# Altium project robotShield.PrjPcb
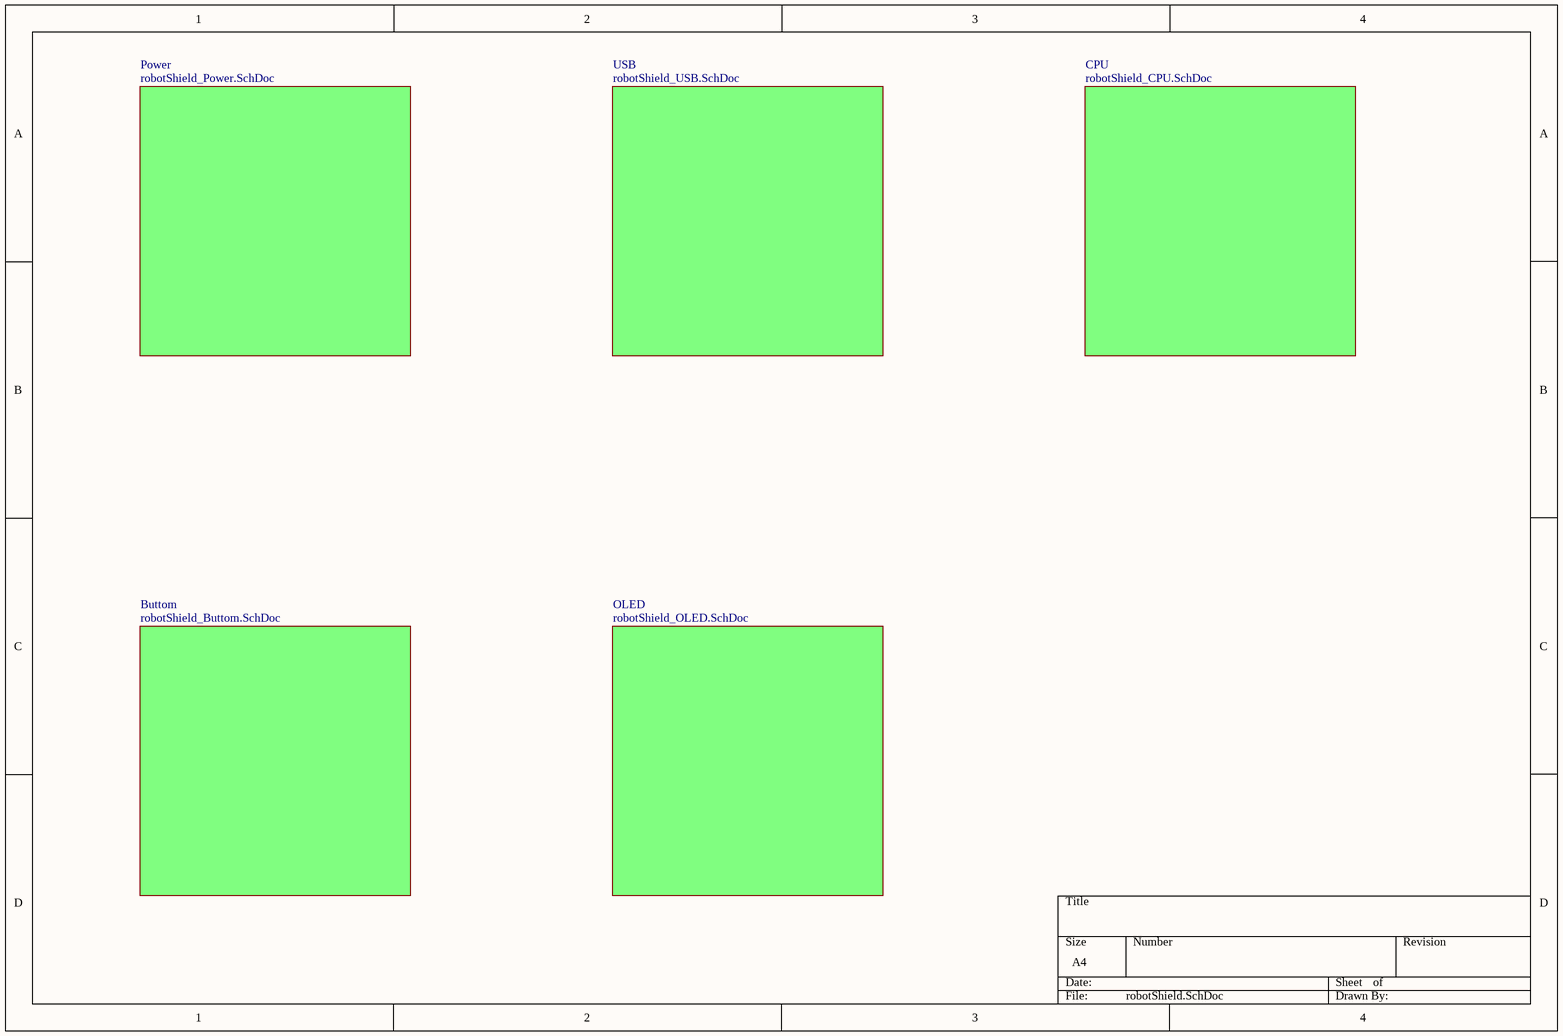
[diagram p0: robotShield.SchDoc]
6 sheets, 66 parts. Net scope: flat (ports and power ports of the same name join across sheets).
Board file: robotShield.PcbDoc
Sheets:
  robotShield.SchDoc
    Power = robotShield_Power.SchDoc
    USB = robotShield_USB.SchDoc
    CPU = robotShield_CPU.SchDoc
    Buttom = robotShield_Buttom.SchDoc
    OLED = robotShield_OLED.SchDoc

## Sheet robotShield.SchDoc
size A4; SheetNumber: 1; SheetTotal: 5

### Sub-sheets
Buttom = robotShield_Buttom.SchDoc: no entries
CPU = robotShield_CPU.SchDoc: no entries
OLED = robotShield_OLED.SchDoc: no entries
Power = robotShield_Power.SchDoc: no entries
USB = robotShield_USB.SchDoc: no entries

## Sheet robotShield_Power.SchDoc
size A4; SheetNumber: 2; SheetTotal: 6
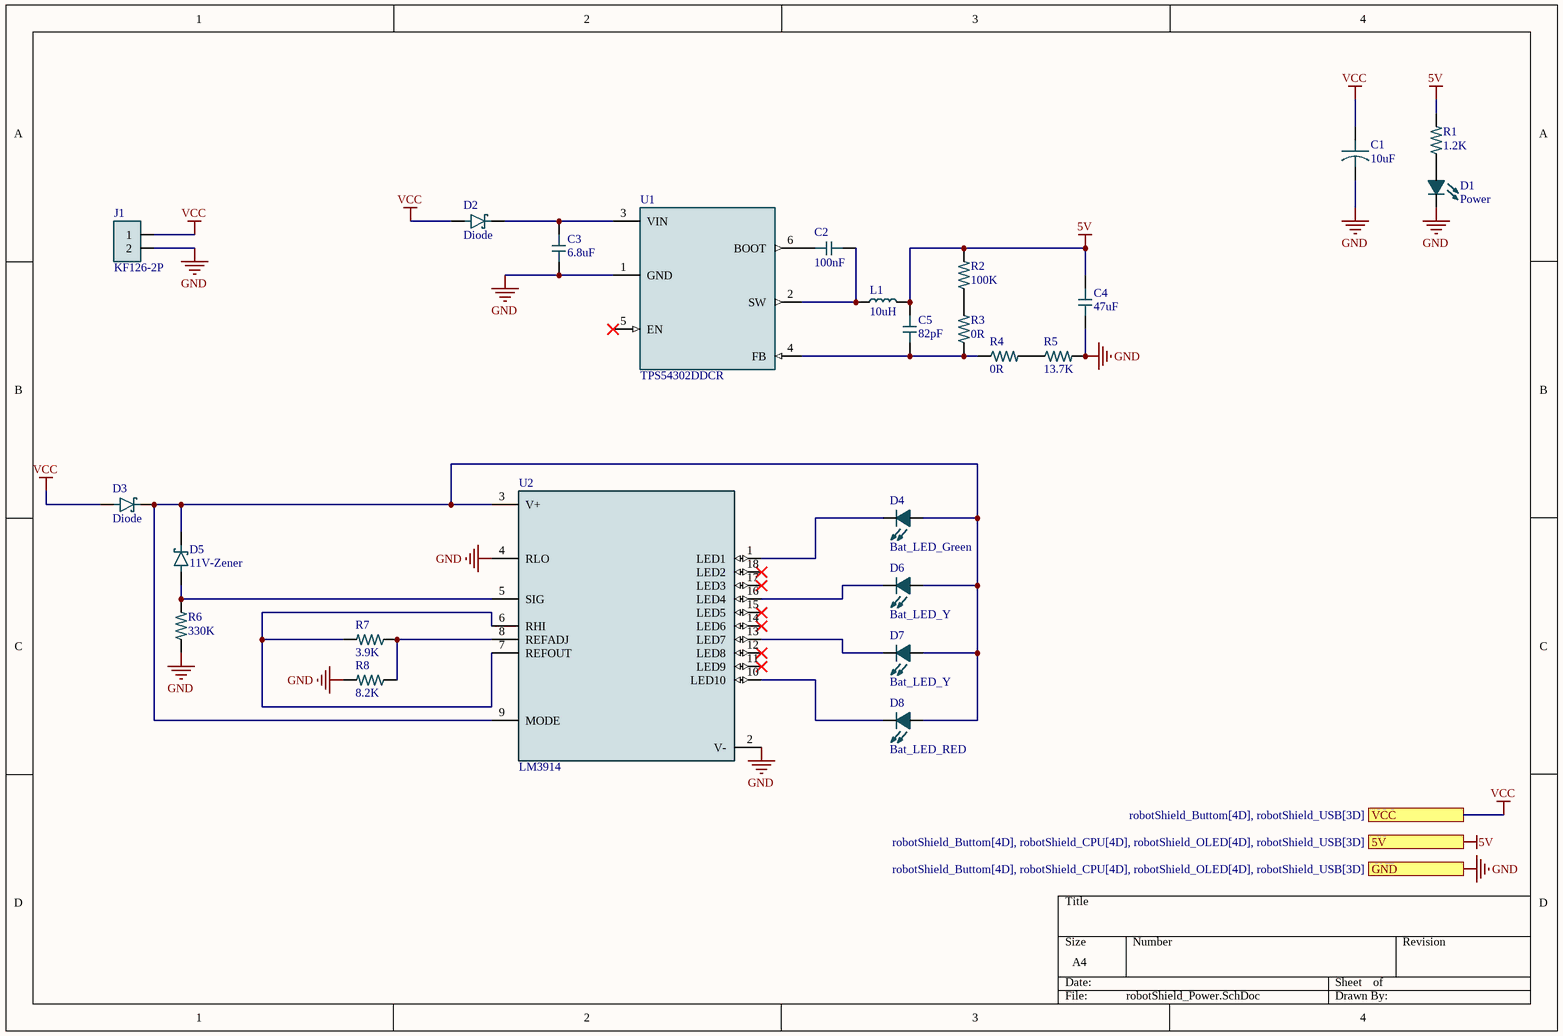
[diagram p1: robotShield_Power.SchDoc]

### Parts
C1  10uF  [TAJA]
C2  100nF  [CAP0603]
C3  6.8uF  [CAP0603]
C4  47uF  [CAP0603]
C5  82pF  [CAP0603]
D1  Power  [LED0603]
D2  Diode  [SS36]
D3  Diode  [SS36]
D4  Bat_LED_Green  [LED0603]
D5  11V-Zener  [MBR0520LT3G]
D6  Bat_LED_Y  [LED0603]
D7  Bat_LED_Y  [LED0603]
D8  Bat_LED_RED  [LED0603]
J1  KF126-2P  [KF126-2P]
L1  10uH  [Inductor1515]
R1  1.2K  [RES0603]
R2  100K  [RES0603]
R3  0R  [RES0603]
R4  0R  [RES0603]
R5  13.7K  [RES0603]
R6  330K  [RES0603]
R7  3.9K  [RES0603]
R8  8.2K  [RES0603]
U1  TPS54302DDCR  [TPS54302DDCR]
U2  LM3914  [LM3914N-1]

### Ports
5V (see robotShield_Buttom[4D], robotShield_CPU[4D], robotShield_OLED[4D], robotShield_USB[3D]), GND (see robotShield_Buttom[4D], robotShield_CPU[4D], robotShield_OLED[4D], robotShield_USB[3D]), VCC (see robotShield_Buttom[4D], robotShield_USB[3D])

### Nets
5V: C4.1 C5.1 L1.2 R1.2 R2.2 ; port 5V
GND: C1.NEG C3.2 C4.2 D1.C J1.2 R5.2 R6.1 R8.2 U1.1(GND) U2.2(V-) U2.4(RLO) ; port GND
VCC: C1.POS D2.A D3.A J1.1 ; port VCC
NetC2_1: C2.1 U1.6(BOOT)
NetC2_2: C2.2 L1.1 U1.2(SW)
NetC3_1: C3.1 D2.C(K) U1.3(VIN)
NetC5_2: C5.2 R3.1 R4.1 U1.4(FB)
NetD1_A: D1.A R1.1
NetD3_C: D3.C(K) D4.A D5.C(K) D6.A D7.A D8.A U2.3(V+) U2.9(MODE)
NetD4_C: D4.C U2.1(LED1)
NetD5_A: D5.A R6.2 U2.5(SIG)
NetD6_C: D6.C U2.16(LED4)
NetD7_C: D7.C U2.13(LED7)
NetD8_C: D8.C U2.10(LED10)
NetR2_1: R2.1 R3.2
NetR4_2: R4.2 R5.1
NetR7_1: R7.1 R8.1 U2.8(REFADJ)
NetR7_2: R7.2 U2.6(RHI) U2.7(REFOUT)

Not connected (* = marked no-connect by the designer): U1 5(EN)*; U2 11(LED9)* 12(LED8)* 14(LED6)* 15(LED5)* 17(LED3)* 18(LED2)*

### Library data of the parts
C1 = CapacitorP: Cap Tant Solid SMD 3216-18 3 Ohm 125Â°C T/R; MF: AVX; MP: TAJA106K010YNJ; SnapEDA_Link: https://www.snapeda.com/parts/TAJA106K010YNJ/AVX/view-part/1683849/?ref=snap; Price: None; Value: *; Availability: Unavailable; Package: 1206 AVX
C2-C5 = Capacitor: CAP SMD; MF: AVX; MP: LD031A101GAB2A; SnapEDA_Link: https://www.snapeda.com/parts/LD031A101GAB2A/AVX/view-part/1973966/?ref=snap; Price: None; Availability: Unavailable; Package: 0603 AVX; Value: *
D1 D4 D6-D8 = LED: MP: LTW-C191TLA; Package: None; Availability: Unavailable; Value: LED; Price: None
D2 D3 D5 = Schottky Diode: MF: Diotec Semiconductor; MP: S1M; Value: *; Price: None; Package: DO-214AC-2 Diotec; Availability: In Stock; SnapEDA_Link: https://www.snapeda.com/parts/S1M/Diotec/view-part/?ref=snap; Purchase-URL: https://pricing.snapeda.com/search/part/S1M/?ref=eda; Check_prices: https://www.snapeda.com/parts/S1M/Diotec/view-part/?ref=eda
J1 = KF126-2P: Terminal Block Connector Wire Receptacle 2 5 mm 30-16 AWG Green 13.5 A 300 V | TE Connectivity 282836-2; SnapEDA_Link: https://www.snapeda.com/parts/282836-2/TE+Connectivity+AMP+Connectors/view-part/?ref=snap; Package: None; Value: KF126-2P; MF: TE Connectivity; MP: 282836-2; Check_prices: https://www.snapeda.com/parts/282836-2/TE+Connectivity+AMP+Connectors/view-part/?ref=eda
L1 = Inductor: Inductor with Inductance 6.8uH Tol.+/-20%; MP: LQM18DN6R8M70B; Package: None; Price: None; Value: *; Availability: Unavailable
R1-R8 = Resistor: RES 0.27 OHM 1% 1/10W; Power_Rating: .1 W; MP: 3-1879460-5; Resistance: 27; MF: TE Connectivity; SnapEDA_Link: https://www.snapeda.com/parts/3-1879460-5/TE+Connectivity/view-part/?ref=snap; Package: 0603; Check_prices: https://www.snapeda.com/parts/3-1879460-5/TE+Connectivity/view-part/?ref=eda; EU_RoHS_Compliance: Compliant with Exemptions; Price: None; Tolerance: 1%; Availability: In Stock; Value: *
U1 = TPS54302DDCR: 4.5-V to 28-V Input, 3-A Output, EMI Friendly Synchronous Step-Down Converter; MF: Texas Instruments; Package: SOT-23-THN-6 Texas Instruments; Price: None; Check_prices: https://www.snapeda.com/parts/TPS54302DDCR/Texas+Instruments/view-part/?ref=eda; Value: *; SnapEDA_Link: https://www.snapeda.com/parts/TPS54302DDCR/Texas+Instruments/view-part/?ref=snap; MP: TPS54302DDCR; Availability: In Stock; Purchase-URL: https://pricing.snapeda.com/search?q=TPS54302DDCR&ref=eda
U2 = LM3914N-1: LED, LCD, Vacuum Fluorescent (VF) Driver 18-PDIP; MF: Texas Instruments; MP: LM3914N-1/NOPB; SnapEDA_Link: https://www.snapeda.com/parts/LM3914N-1/NOPB/Texas+Instruments/view-part/?ref=snap; Package: PDIP-18 Texas Instruments; Value: *; Check_prices: https://www.snapeda.com/parts/LM3914N-1/NOPB/Texas+Instruments/view-part/?ref=eda

## Sheet robotShield_USB.SchDoc
size A4; SheetNumber: 3; SheetTotal: 6
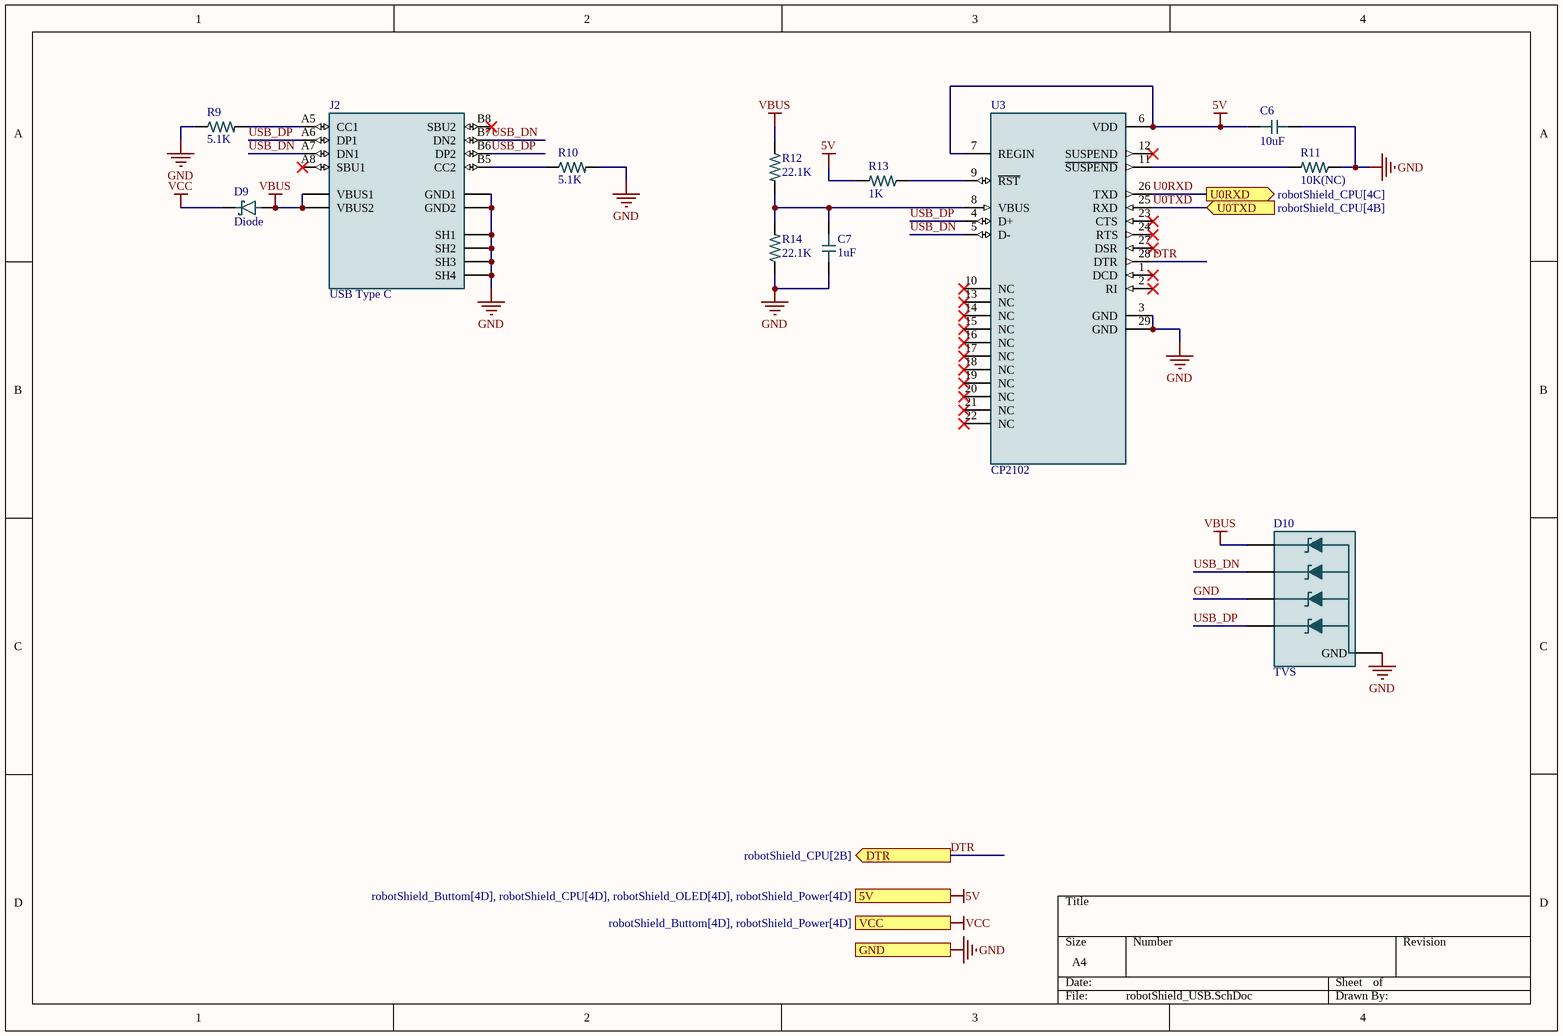
[diagram p2: robotShield_USB.SchDoc]

### Parts
C6  10uF  [CAP0603]
C7  1uF  [CAP0603]
D9  Diode  [MBR0520LT3G]
D10  TVS  [TVS-SE05T1D12GZ]
J2  USB Type C  [USB_Type_C_16pin]
R9  5.1K  [RES0603]
R10  5.1K  [RES0603]
R11  10K(NC)  [RES0603]
R12  22.1K  [RES0603]
R13  1K  [RES0603]
R14  22.1K  [RES0603]
U3  CP2102  [CP2102]

### Ports
5V (see robotShield_Buttom[4D], robotShield_CPU[4D], robotShield_OLED[4D], robotShield_Power[4D]), DTR (out, see robotShield_CPU[2B]), GND (see robotShield_Buttom[4D], robotShield_CPU[4D], robotShield_OLED[4D], robotShield_Power[4D]), U0RXD (out, see robotShield_CPU[4C]), U0TXD (in, see robotShield_CPU[4B]), VCC (see robotShield_Buttom[4D], robotShield_Power[4D])

### Nets
5V: C6.1 R13.2 U3.6(VDD) U3.7(REGIN) ; port 5V
GND: C6.2 C7.2 D10.3(GND) D10.4(I/O_4) J2.A1B12(GND1) J2.B1A12(GND2) J2.SH1 J2.SH2 J2.SH3 J2.SH4 R9.1 R10.2 R11.1 R14.1 U3.3(GND) U3.29(GND) ; port GND
VBUS: D9.A D10.1(I/O_1) J2.A4B9(VBUS1) J2.B4A9(VBUS2) R12.1
VCC: D9.C(K) ; port VCC
DTR: U3.28(DTR) ; port DTR
U0RXD: U3.26(TXD) ; port U0RXD  [project net D0/RXD]
U0TXD: U3.25(RXD) ; port U0TXD  [project net D1/TXD]
USB_DN: D10.2(I/O_2) J2.A7(DN1) J2.B7(DN2) U3.5(D-)
USB_DP: D10.5(I/O_5) J2.A6(DP1) J2.B6(DP2) U3.4(D+)
NetC7_1: C7.1 R12.2 R14.2 U3.8(VBUS)
NetJ2_A5: J2.A5(CC1) R9.2
NetJ2_B5: J2.B5(CC2) R10.1
NetR11_2: R11.2 U3.11(~{SUSPEND})
NetR13_1: R13.1 U3.9(~{RST})

Not connected (* = marked no-connect by the designer): J2 A8(SBU1)* B8(SBU2)*; U3 1(DCD)* 2(RI)* 10(NC)* 12(SUSPEND)* 13(NC)* 14(NC)* 15(NC)* 16(NC)* 17(NC)* 18(NC)* 19(NC)* 20(NC)* 21(NC)* 22(NC)* 23(CTS)* 24(RTS)* 27(DSR)*

### Library data of the parts
C6 C7 = Capacitor: CAP SMD; MF: AVX; MP: LD031A101GAB2A; SnapEDA_Link: https://www.snapeda.com/parts/LD031A101GAB2A/AVX/view-part/1973966/?ref=snap; Price: None; Availability: Unavailable; Package: 0603 AVX; Value: *
D9 = Schottky Diode: MF: Diotec Semiconductor; MP: S1M; Value: *; Price: None; Package: DO-214AC-2 Diotec; Availability: In Stock; SnapEDA_Link: https://www.snapeda.com/parts/S1M/Diotec/view-part/?ref=snap; Purchase-URL: https://pricing.snapeda.com/search/part/S1M/?ref=eda; Check_prices: https://www.snapeda.com/parts/S1M/Diotec/view-part/?ref=eda
D10 = TVS_SE05NRC14GT: ESD8104MUTAG, Quad Uni-Directional ESD Protection Diode, 10-Pin UDFN; MF: ON Semiconductor; MP: ESD8104MUTAG; Availability: Unavailable; Price: None; SnapEDA_Link: https://www.snapeda.com/parts/ESD8104MUTAG/ON%20Semiconductor/view-part/220668/?ref=snap; Package: UDFN-10 ON Semiconductor; Value: *; DigiKey-Purchase-URL: https://snapeda.com/shop?store=DigiKey&id=220668
J2 = USB_Type_C _16pin: USB Type C - Connector, Top-mount SMT, 16pos | Molex Incorporated 217179-0001; SnapEDA_Link: https://www.snapeda.com/parts/217179-0001/Molex/view-part/?ref=snap; Package: None; Value: *; MF: Molex; MP: 217179-0001; Check_prices: https://www.snapeda.com/parts/217179-0001/Molex/view-part/?ref=eda; ComponentLink1Description: link; ComponentLink1URL: https://roboeq.ir/products/detail/1501044/کانکتور-USB-Type-C-مادگی-16-پین-SMD/
R9-R14 = Resistor: as R1 on sheet robotShield_Power; SnapEDA_Link: https://www.snapeda.com/parts/3-1879460-5/TE+Connectivity/view-part/?ref=snap; Package: 0603; Check_prices: https://www.snapeda.com/parts/3-1879460-5/TE+Connectivity/view-part/?ref=eda; EU_RoHS_Compliance: Compliant with Exemptions; Price: None; Tolerance: 1%; Availability: In Stock; Value: *
U3 = CP2102: CP2102N USB 2.0 to UART (RS232) Bridge Interface Evaluation Board; MF: Silicon Labs; Purchase-URL: https://pricing.snapeda.com/search/part/CP2102/?ref=eda; Package: WFQFN-20 Silicon Labs; Value: *; Check_prices: https://www.snapeda.com/parts/CP2102/Silicon+Labs/view-part/?ref=eda; SnapEDA_Link: https://www.snapeda.com/parts/CP2102/Silicon+Labs/view-part/?ref=snap; Availability: In Stock; Price: None; MP: CP2102

## Sheet robotShield_CPU.SchDoc
size A4; SheetNumber: 4; SheetTotal: 6
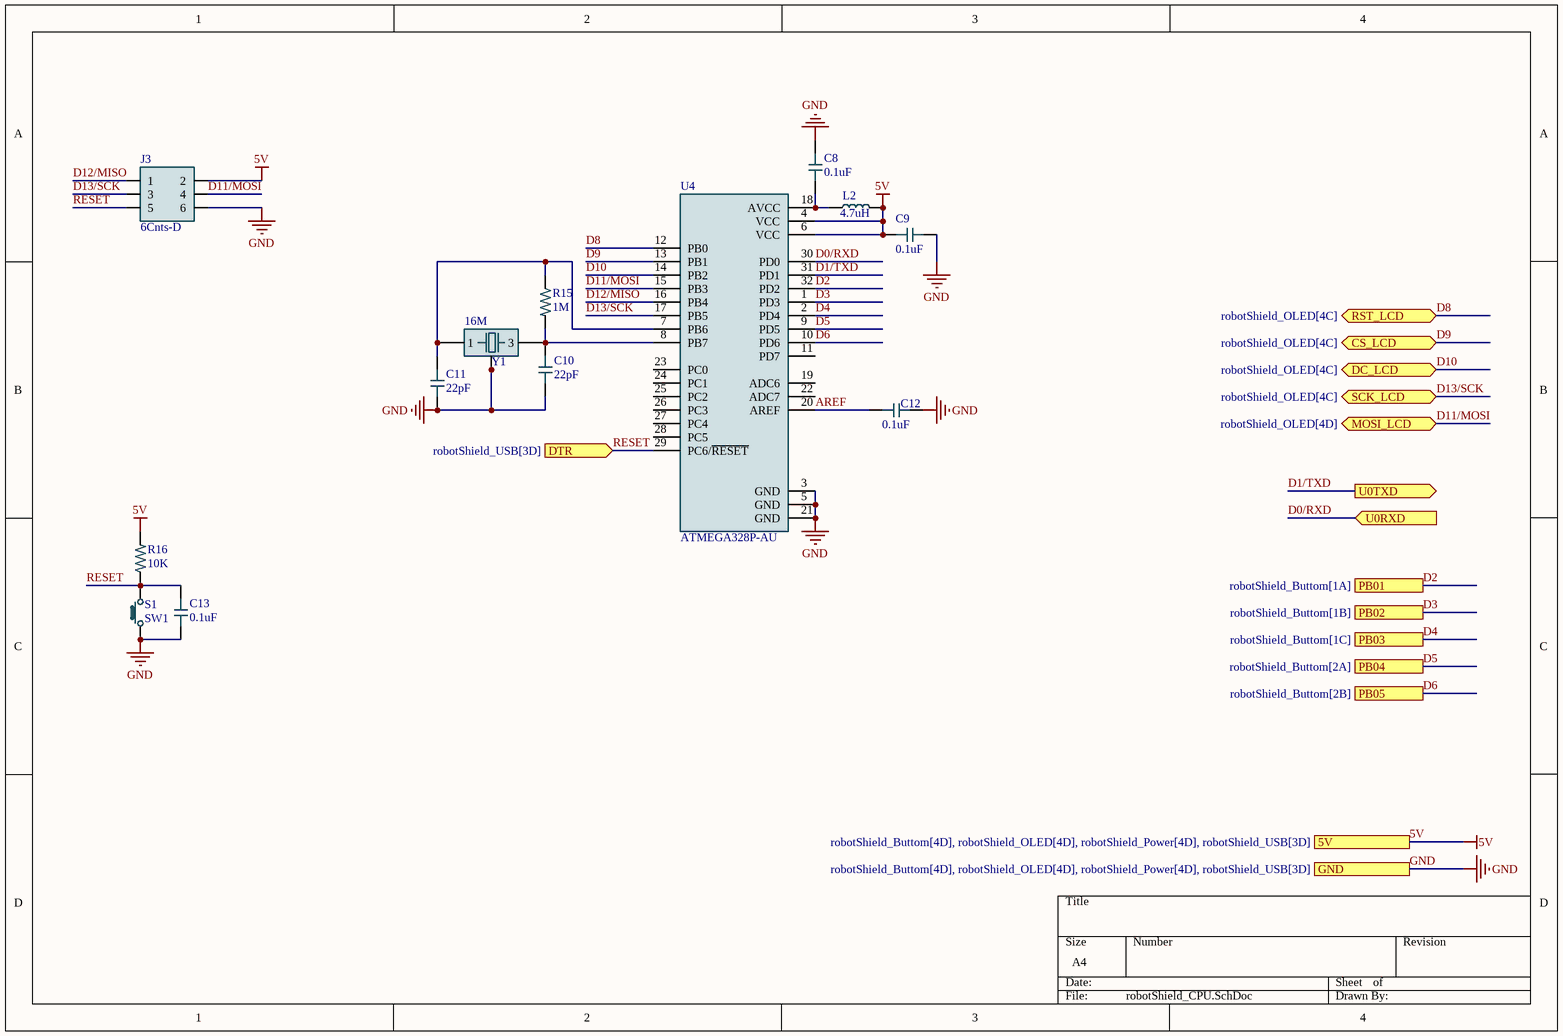
[diagram p3: robotShield_CPU.SchDoc]

### Parts
C8  0.1uF  [CAP0603]
C9  0.1uF  [CAP0603]
C10  22pF  [CAP0603]
C11  22pF  [CAP0603]
C12  0.1uF  [CAP0603]
C13  0.1uF  [CAP0603]
J3  6Cnts-D  [6Cnts-D-SMD]
L2  4.7uH  [Inductor0603]
R15  1M  [RES0603]
R16  10K  [RES0603]
S1  SW1  [Pushbutton_Tactile]
U4  ATMEGA328P-AU  [ATMEGA328P-AU]
Y1  16M  [crystal-2520]

### Ports
5V (see robotShield_Buttom[4D], robotShield_OLED[4D], robotShield_Power[4D], robotShield_USB[3D]), CS_LCD (bidir, see robotShield_OLED[4C]), DC_LCD (bidir, see robotShield_OLED[4C]), DTR (in, see robotShield_USB[3D]), GND (see robotShield_Buttom[4D], robotShield_OLED[4D], robotShield_Power[4D], robotShield_USB[3D]), MOSI_LCD (bidir, see robotShield_OLED[4D]), PB01 (see robotShield_Buttom[1A]), PB02 (see robotShield_Buttom[1B]), PB03 (see robotShield_Buttom[1C]), PB04 (see robotShield_Buttom[2A]), PB05 (see robotShield_Buttom[2B]), RST_LCD (bidir, see robotShield_OLED[4C]), SCK_LCD (bidir, see robotShield_OLED[4C]), U0RXD (in, see robotShield_USB[4A]), U0TXD (out, see robotShield_USB[4A])

### Nets
5V: C9.1 J3.2 L2.2 R16.2 U4.4(VCC) U4.6(VCC) ; port 5V
GND: C8.1 C9.2 C10.2 C11.2 C12.2 C13.2 J3.6 S1.1 U4.3(GND) U4.5(GND) U4.21(GND) Y1.2(GND) Y1.4(GND) ; port GND
AREF: C12.1 U4.20(AREF)
D0/RXD: U4.30(PD0) ; port U0RXD
D1/TXD: U4.31(PD1) ; port U0TXD
D2: U4.32(PD2) ; port PB01
D3: U4.1(PD3) ; port PB02
D4: U4.2(PD4) ; port PB03
D5: U4.9(PD5) ; port PB04
D6: U4.10(PD6) ; port PB05
D8: U4.12(PB0) ; port RST_LCD
D9: U4.13(PB1) ; port CS_LCD  [project net CS_LCD]
D10: U4.14(PB2) ; port DC_LCD
D11/MOSI: J3.4 U4.15(PB3) ; port MOSI_LCD
D12/MISO: J3.1 U4.16(PB4)
D13/SCK: J3.3 U4.17(PB5) ; port SCK_LCD
RESET: C13.1 J3.5 R16.1 S1.2 U4.29(PC6/~{RESET}) ; port DTR  [project net DTR]
NetC8_2: C8.2 L2.1 U4.18(AVCC)
NetC10_1: C10.1 R15.2 U4.8(PB7) Y1.3
NetC11_1: C11.1 R15.1 U4.7(PB6) Y1.1

Not connected (* = marked no-connect by the designer): U4 11(PD7) 19(ADC6) 22(ADC7) 23(PC0) 24(PC1) 25(PC2) 26(PC3) 27(PC4) 28(PC5)

### Library data of the parts
C8-C13 = Capacitor: CAP SMD; MF: AVX; MP: LD031A101GAB2A; SnapEDA_Link: https://www.snapeda.com/parts/LD031A101GAB2A/AVX/view-part/1973966/?ref=snap; Price: None; Availability: Unavailable; Package: 0603 AVX; Value: *
J3 = 6Cnts-D: MP: MTSW-103-22-S-D-430; Package: None; Price: None; Value: *; Availability: Unavailable
L2 = Inductor: as L1 on sheet robotShield_Power; Package: None; Price: None; Value: *; Availability: Unavailable
R15 R16 = Resistor: as R1 on sheet robotShield_Power; SnapEDA_Link: https://www.snapeda.com/parts/3-1879460-5/TE+Connectivity/view-part/?ref=snap; Package: 0603; Check_prices: https://www.snapeda.com/parts/3-1879460-5/TE+Connectivity/view-part/?ref=eda; EU_RoHS_Compliance: Compliant with Exemptions; Price: None; Tolerance: 1%; Availability: In Stock; Value: *
S1 = Pushbutton: Switch,Pushbutton,Tactile,SPST
U4 = ATMEGA328P-AU: AVR ATmega Microcontroller IC 8-Bit 20MHz 32KB (16K x 16) FLASH 32-TQFP (7x7); MF: Microchip; SnapEDA_Link: https://www.snapeda.com/parts/ATMEGA328P-AU/Microchip/view-part/?ref=snap; Package: TQFP-32 Microchip; Value: *; MP: ATMEGA328P-AU; Check_prices: https://www.snapeda.com/parts/ATMEGA328P-AU/Microchip/view-part/?ref=eda
Y1 = crystal-4P: 40MHz 10pF ±10ppm SMD-4P Crystals; MF: EPSON; MP: TSX-3225 16.0000MF18X-AC3; SnapEDA_Link: https://www.snapeda.com/parts/TSX-3225%2016.0000MF18X-AC3/EPSON/view-part/?ref=snap; Package: SMD-4 EPSON; Value: *; Check_prices: https://www.snapeda.com/parts/TSX-3225%2016.0000MF18X-AC3/EPSON/view-part/?ref=eda

## Sheet robotShield_Buttom.SchDoc
size A4; SheetNumber: 5; SheetTotal: 6
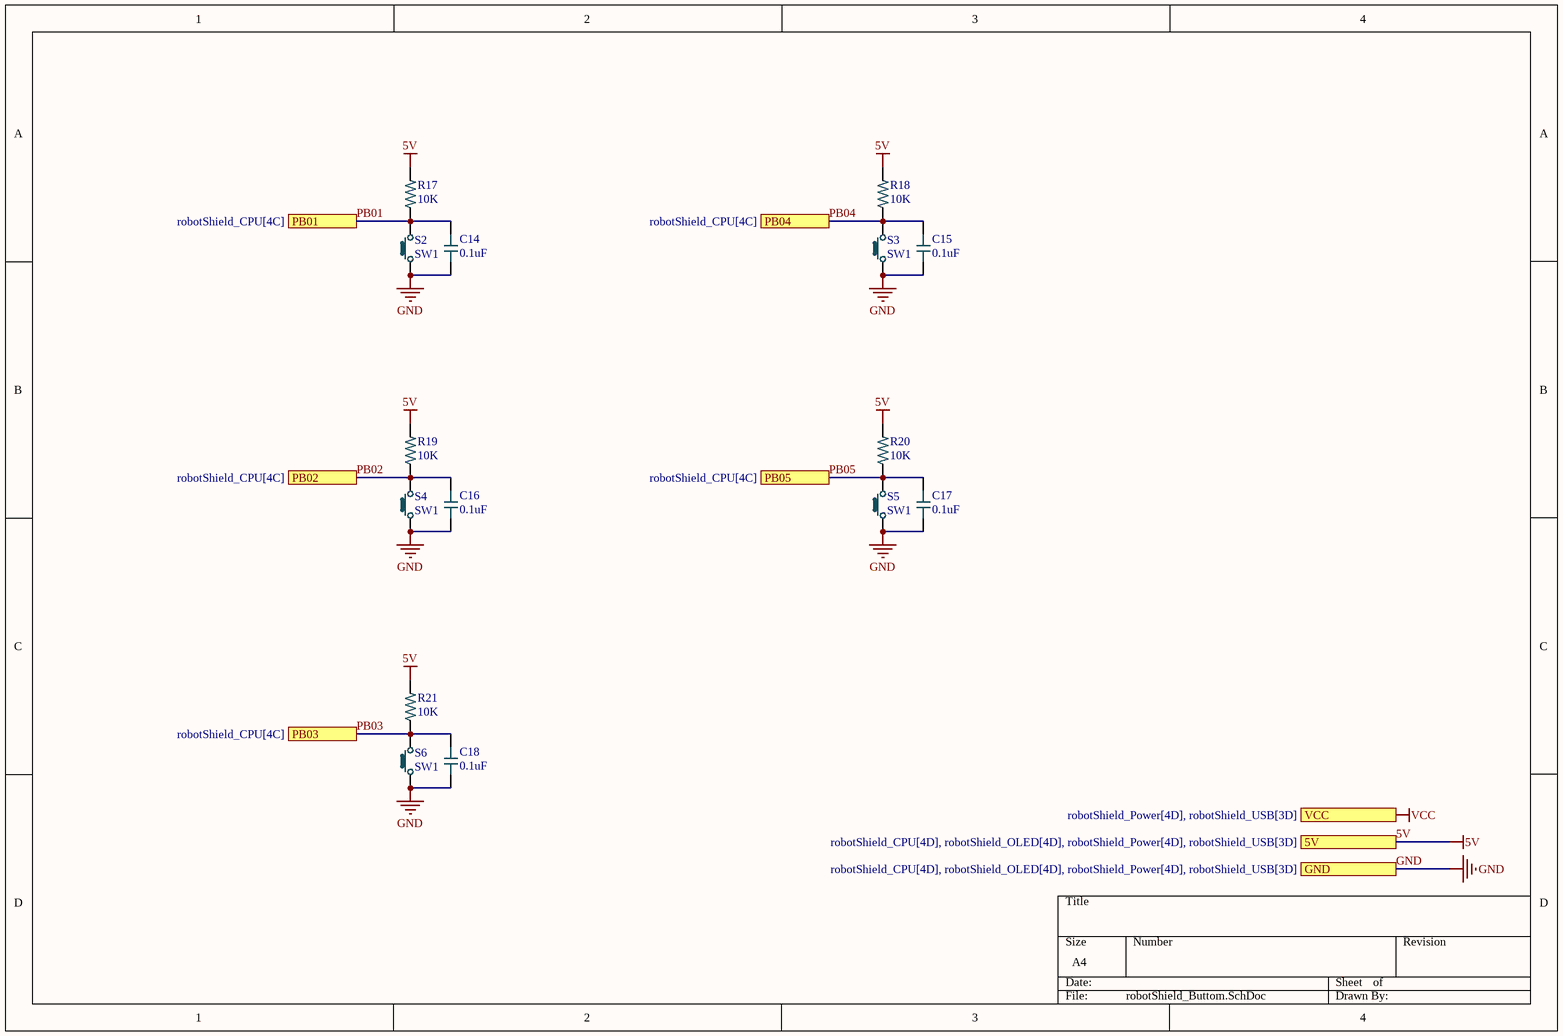
[diagram p4: robotShield_Buttom.SchDoc]

### Parts
C14  0.1uF  [CAP0603]
C15  0.1uF  [CAP0603]
C16  0.1uF  [CAP0603]
C17  0.1uF  [CAP0603]
C18  0.1uF  [CAP0603]
R17  10K  [RES0603]
R18  10K  [RES0603]
R19  10K  [RES0603]
R20  10K  [RES0603]
R21  10K  [RES0603]
S2  SW1  [Pushbutton_Tactile]
S3  SW1  [Pushbutton_Tactile]
S4  SW1  [Pushbutton_Tactile]
S5  SW1  [Pushbutton_Tactile]
S6  SW1  [Pushbutton_Tactile]

### Ports
5V (see robotShield_CPU[4D], robotShield_OLED[4D], robotShield_Power[4D], robotShield_USB[3D]), GND (see robotShield_CPU[4D], robotShield_OLED[4D], robotShield_Power[4D], robotShield_USB[3D]), PB01 (see robotShield_CPU[4C]), PB02 (see robotShield_CPU[4C]), PB03 (see robotShield_CPU[4C]), PB04 (see robotShield_CPU[4C]), PB05 (see robotShield_CPU[4C]), VCC (see robotShield_Power[4D], robotShield_USB[3D])

### Nets
5V: R17.2 R18.2 R19.2 R20.2 R21.2 ; port 5V
GND: C14.2 C15.2 C16.2 C17.2 C18.2 S2.1 S3.1 S4.1 S5.1 S6.1 ; port GND
PB01: C14.1 R17.1 S2.2 ; port PB01  [project net D2]
PB02: C16.1 R19.1 S4.2 ; port PB02  [project net D3]
PB03: C18.1 R21.1 S6.2 ; port PB03  [project net D4]
PB04: C15.1 R18.1 S3.2 ; port PB04  [project net D5]
PB05: C17.1 R20.1 S5.2 ; port PB05  [project net D6]

### Library data of the parts
C14-C18 = Capacitor: CAP SMD; MF: AVX; MP: LD031A101GAB2A; SnapEDA_Link: https://www.snapeda.com/parts/LD031A101GAB2A/AVX/view-part/1973966/?ref=snap; Price: None; Availability: Unavailable; Package: 0603 AVX; Value: *
R17-R21 = Resistor: as R1 on sheet robotShield_Power; SnapEDA_Link: https://www.snapeda.com/parts/3-1879460-5/TE+Connectivity/view-part/?ref=snap; Package: 0603; Check_prices: https://www.snapeda.com/parts/3-1879460-5/TE+Connectivity/view-part/?ref=eda; EU_RoHS_Compliance: Compliant with Exemptions; Price: None; Tolerance: 1%; Availability: In Stock; Value: *
S2-S6 = Pushbutton: Switch,Pushbutton,Tactile,SPST

## Sheet robotShield_OLED.SchDoc
size A4; SheetNumber: 6; SheetTotal: 6
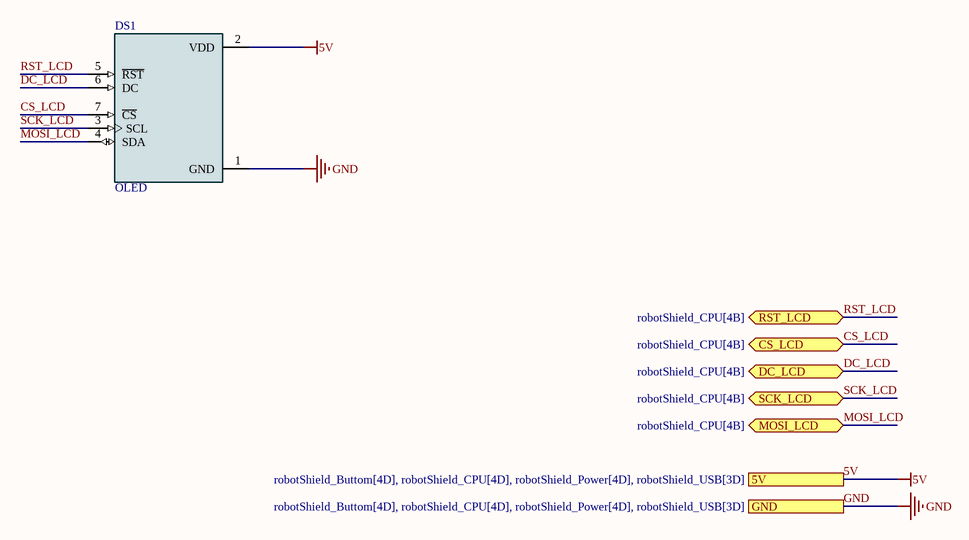
[diagram p5: robotShield_OLED.SchDoc]

### Parts
DS1  OLED  [OLD_SPI_1.3]

### Ports
5V (see robotShield_Buttom[4D], robotShield_CPU[4D], robotShield_Power[4D], robotShield_USB[3D]), CS_LCD (bidir, see robotShield_CPU[4B]), DC_LCD (bidir, see robotShield_CPU[4B]), GND (see robotShield_Buttom[4D], robotShield_CPU[4D], robotShield_Power[4D], robotShield_USB[3D]), MOSI_LCD (bidir, see robotShield_CPU[4B]), RST_LCD (bidir, see robotShield_CPU[4B]), SCK_LCD (bidir, see robotShield_CPU[4B])

### Nets
5V: DS1.2(VDD) ; port 5V
GND: DS1.1(GND) ; port GND
CS_LCD: DS1.7(~{CS}) ; port CS_LCD
DC_LCD: DS1.6(DC) ; port DC_LCD  [project net D10]
MOSI_LCD: DS1.4(SDA) ; port MOSI_LCD  [project net D11/MOSI]
RST_LCD: DS1.5(~{RST}) ; port RST_LCD  [project net D8]
SCK_LCD: DS1.3(SCL) ; port SCK_LCD  [project net D13/SCK]

### Library data of the parts
DS1 = OLED: Non-Touch Graphic LCD Display Module - Blue OLED SPI 1.3 (33.02mm) 128 x 64; MF: Orient Display; MP: AOM12864A0-1.3BW-ANO; SnapEDA_Link: https://www.snapeda.com/parts/AOM12864A0-1.3BW-ANO/Orient+Display/view-part/?ref=snap; Package: None; Value: *; Check_prices: https://www.snapeda.com/parts/AOM12864A0-1.3BW-ANO/Orient+Display/view-part/?ref=eda

## Nets that join several sheets
5V: robotShield_Power (5 pins), robotShield_USB (C6.1 R13.2 U3.6 U3.7), robotShield_CPU (6 pins), robotShield_Buttom (5 pins), robotShield_OLED (DS1.2)
GND: robotShield_Power (11 pins), robotShield_USB (16 pins), robotShield_CPU (13 pins), robotShield_Buttom (10 pins), robotShield_OLED (DS1.1)
VCC: robotShield_Power (C1.POS D2.A D3.A J1.1), robotShield_USB (D9.C)
CS_LCD: robotShield_CPU (U4.13), robotShield_OLED (DS1.7)
D0/RXD: robotShield_USB (U3.26), robotShield_CPU (U4.30)
D1/TXD: robotShield_USB (U3.25), robotShield_CPU (U4.31)
D2: robotShield_CPU (U4.32), robotShield_Buttom (C14.1 R17.1 S2.2)
D3: robotShield_CPU (U4.1), robotShield_Buttom (C16.1 R19.1 S4.2)
D4: robotShield_CPU (U4.2), robotShield_Buttom (C18.1 R21.1 S6.2)
D5: robotShield_CPU (U4.9), robotShield_Buttom (C15.1 R18.1 S3.2)
D6: robotShield_CPU (U4.10), robotShield_Buttom (C17.1 R20.1 S5.2)
D8: robotShield_CPU (U4.12), robotShield_OLED (DS1.5)
D10: robotShield_CPU (U4.14), robotShield_OLED (DS1.6)
D11/MOSI: robotShield_CPU (J3.4 U4.15), robotShield_OLED (DS1.4)
D13/SCK: robotShield_CPU (J3.3 U4.17), robotShield_OLED (DS1.3)
DTR: robotShield_USB (U3.28), robotShield_CPU (5 pins)